# EAGLE schematic EE445L_Baseline_Schematic (EAGLE 9.6.2)
Fall 2021 EE445L This is the baseline schematic
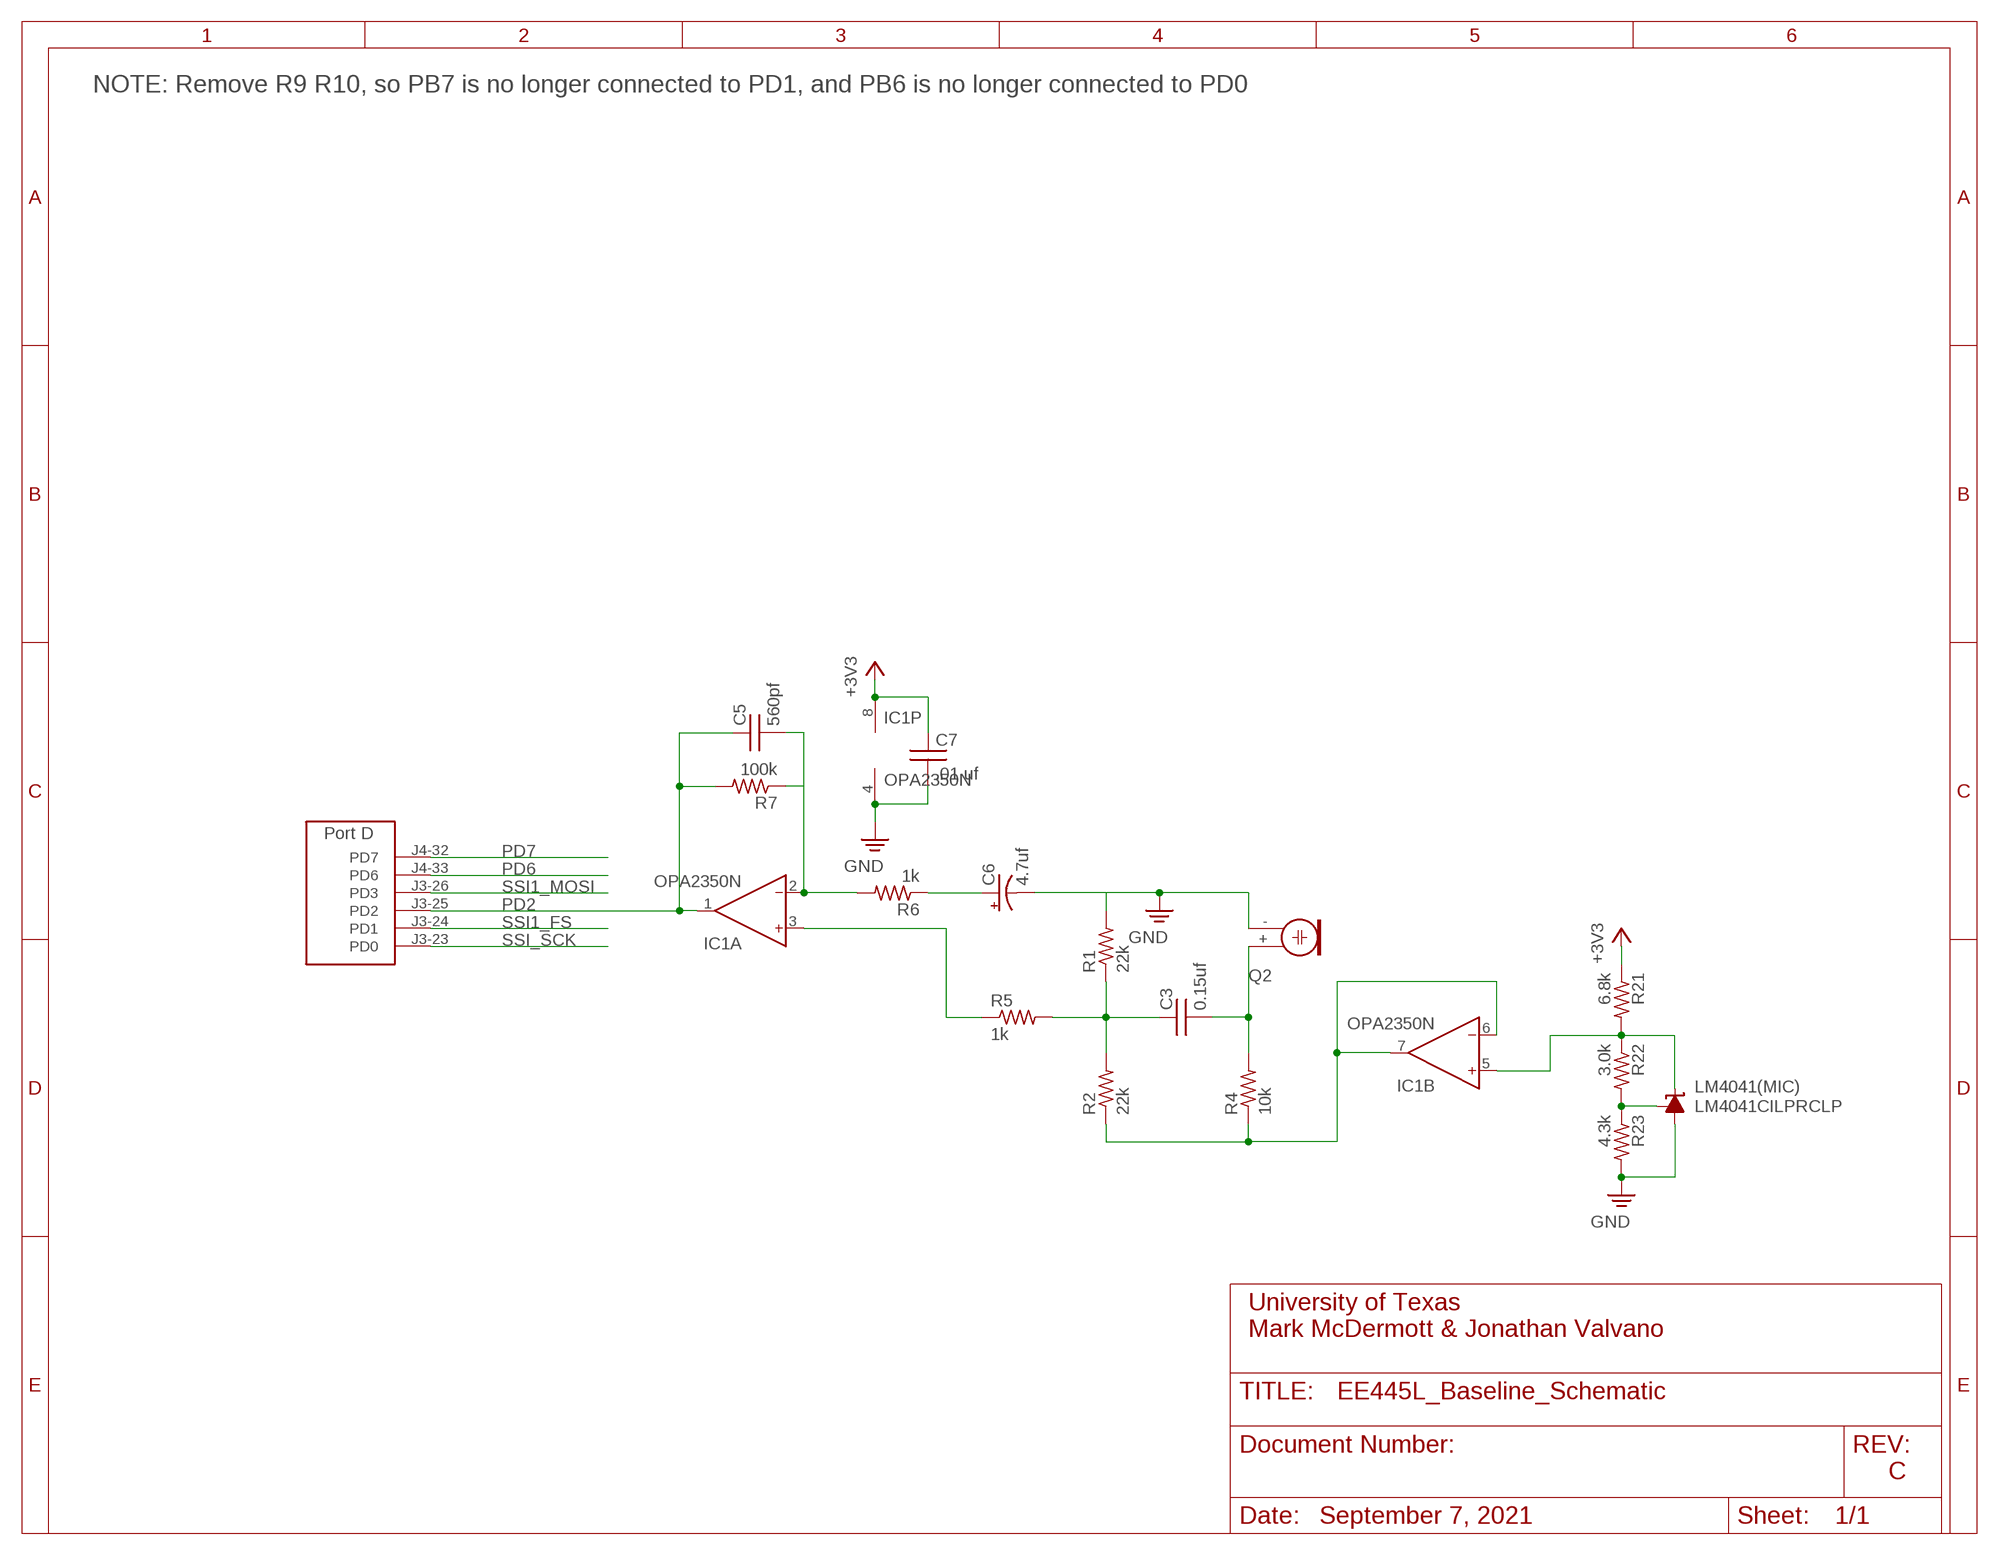
[diagram p0: schematic, sheet 1, part 1 of 2]
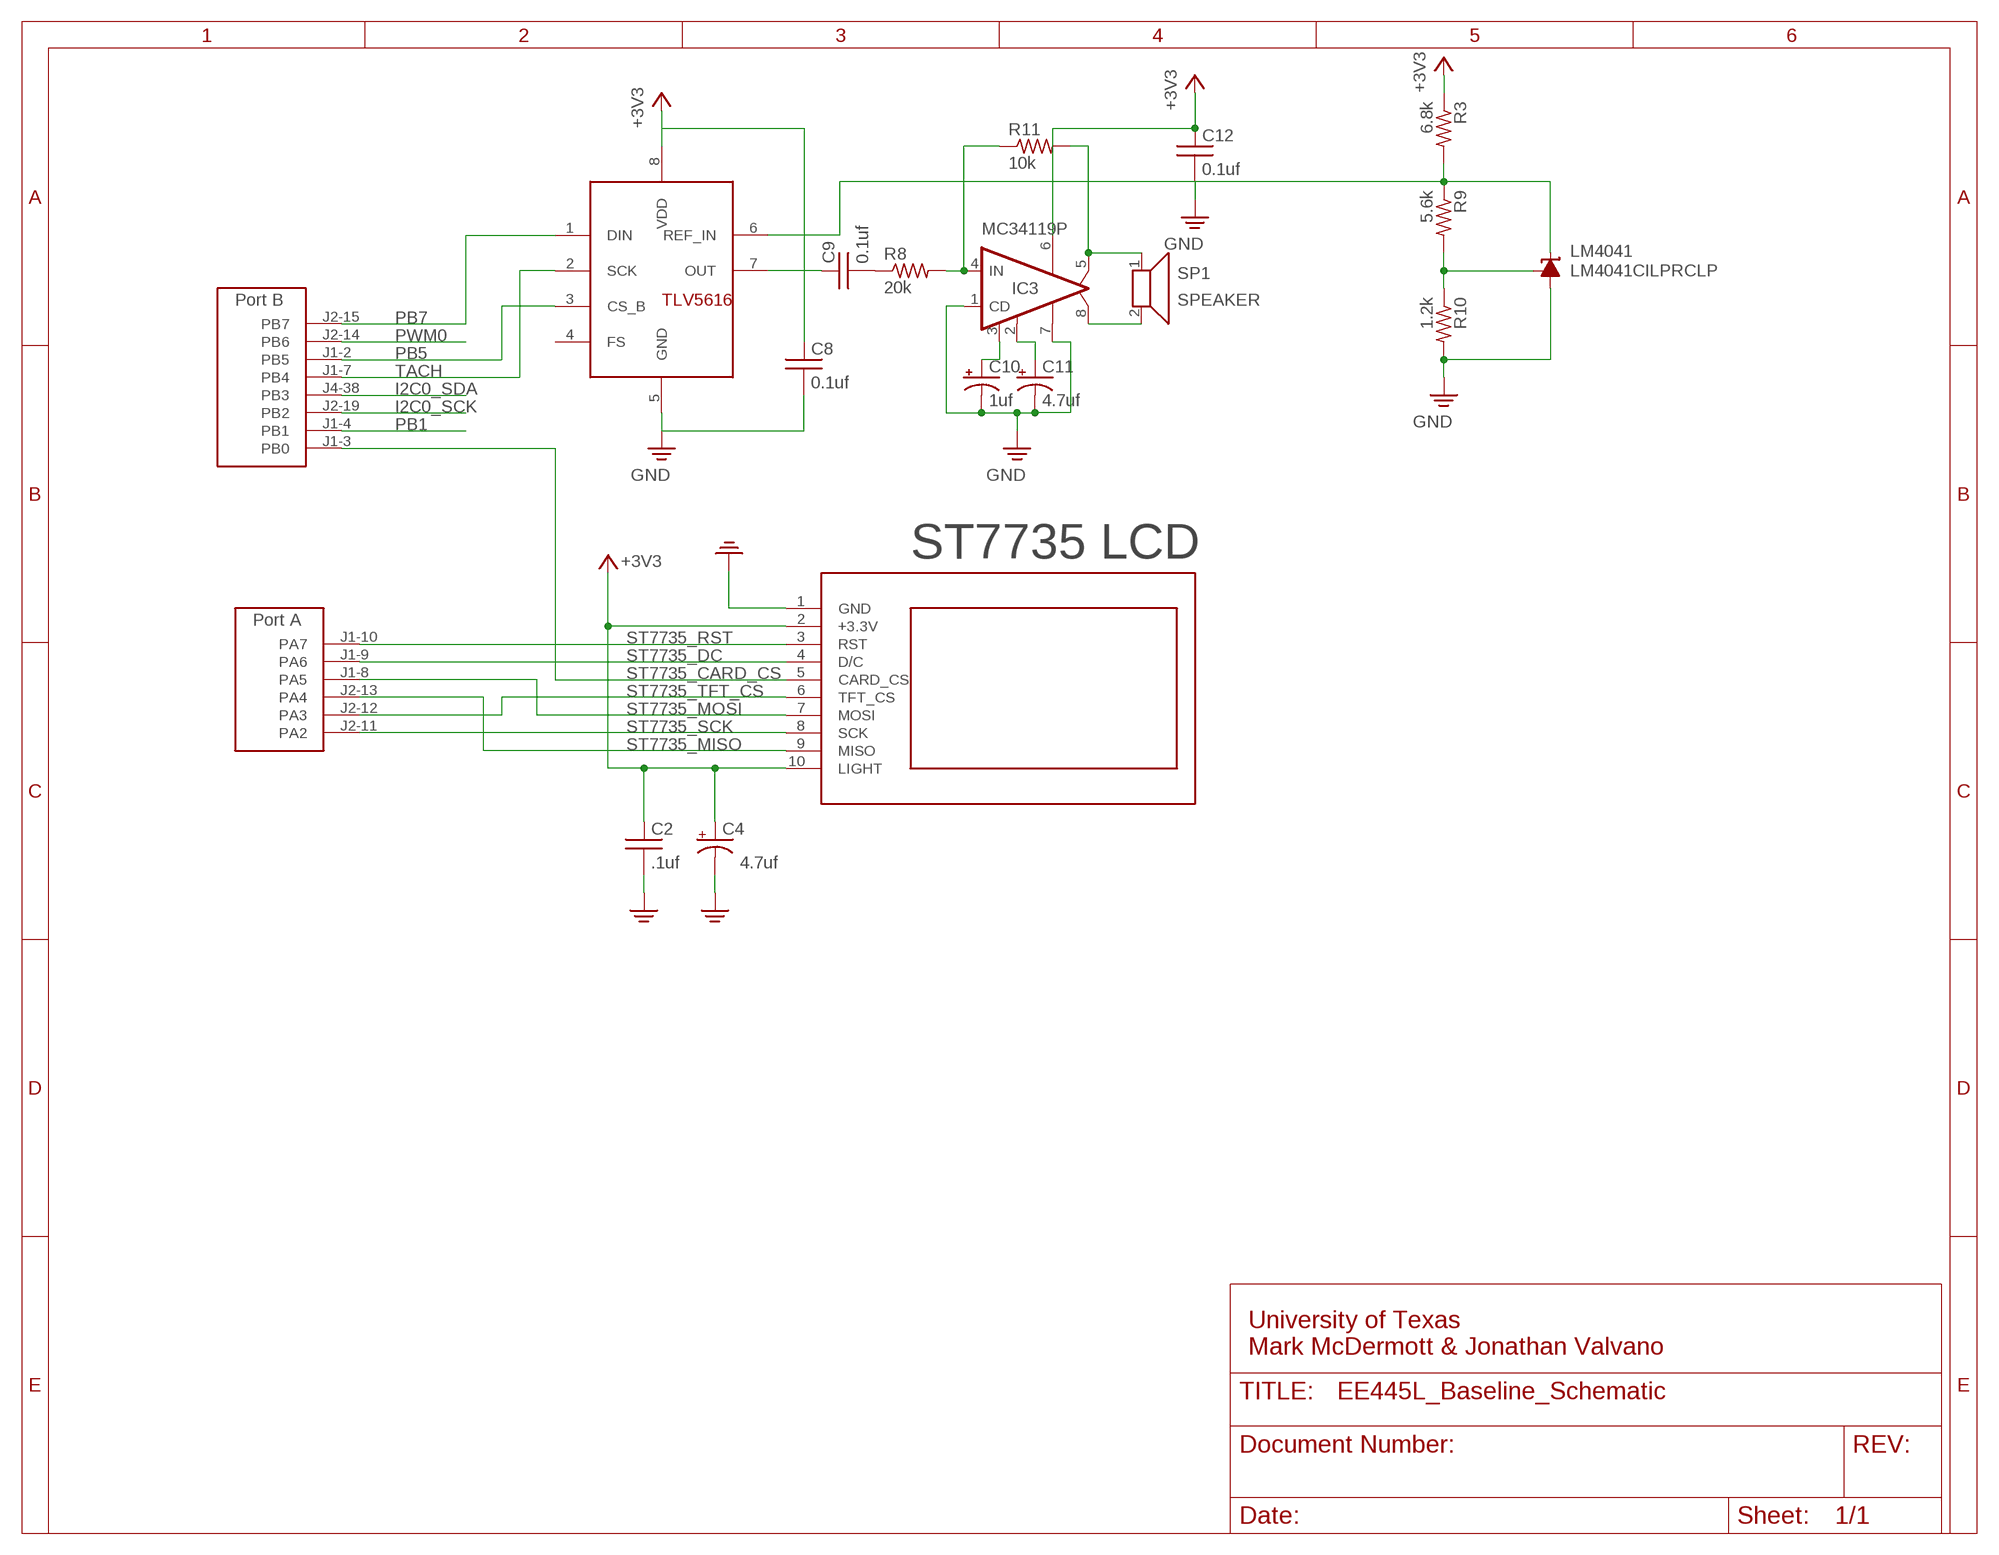
[diagram p1: schematic, sheet 1, part 2 of 2]

## Parts
C2  .1uf  CAPACITOR050-024X044  [CAP200MIL]
C3  0.15uf  CAPACITOR025-024X044  [CAP100MIL]
C4  4.7uf  CAPACITOR_POLARIZEDE5-6  [CAP200MILPOLARIZED]
C5  560pf  CAPACITOR025-024X044  [CAP100MIL]
C6  4.7uf  CAPACITOR_POLARIZEDE5-6  [CAP200MILPOLARIZED]
C7  .01 uf  CAPACITOR025-024X044  [CAP100MIL]
C8  0.1uf  CAPACITOR025-024X044  [CAP100MIL]
C9  0.1uf  CAPACITOR025-024X044  [CAP100MIL]
C10  1uf  CAPACITOR_POLARIZEDE5-6  [CAP200MILPOLARIZED]
C11  4.7uf  CAPACITOR_POLARIZEDE5-6  [CAP200MILPOLARIZED]
C12  0.1uf  CAPACITOR025-024X044  [CAP100MIL]
IC1  OPA2350N  [DIL08]
IC3  MC34119P  [DIL08]
LM4041  LM4041CILPRCLP  [LP_O-PBCY-W3]
LM4041(MIC)  LM4041CILPRCLP  [LP_O-PBCY-W3]
Q2  ELECTRET  [9.7ELECTRET]
R1  22k  RESISTOR0204/5  [RES200MIL]
R2  22k  RESISTOR0204/5  [RES200MIL]
R3  6.8k  RESISTOR0204/7  [RES300MIL]
R4  10k  RESISTOR0204/5  [RES200MIL]
R5  1k  RESISTOR0204/5  [RES200MIL]
R6  1k  RESISTOR0204/5  [RES200MIL]
R7  100k  RESISTOR0204/5  [RES200MIL]
R8  20k  RESISTOR0204/5  [RES200MIL]
R9  5.6k  RESISTOR0204/7  [RES300MIL]
R10  1.2k  RESISTOR0204/7  [RES300MIL]
R11  10k  RESISTOR0204/7  [RES300MIL]
R21  6.8k  RESISTOR0204/7  [RES300MIL]
R22  3.0k  RESISTOR0204/7  [RES300MIL]
R23  4.3k  RESISTOR0204/7  [RES300MIL]
SP1  SPEAKER  [1X02]
U$1  TLV5616  [DIL08]
U$2  TM4C_BP  [TM4C_BOOSTER_PACK]
U$3  ST7735  [ST7735]

## Nets
+3V3: C2.1 C4.+ C7.1 C8.1 C12.1 IC1.8(P:V+) IC3.6(VCC) R3.1 R21.1 U$1.8(VDD) U$3.2(+3.3V) U$3.10(LIGHT)
GND: C2.2 C4.- C6.- C7.2 C8.2 C10.- C11.- C12.2 IC1.4(P:V-) IC3.1(CD) IC3.7(GND) LM4041(MIC).3(A) LM4041.3(A) Q2.- R1.2 R10.2 R23.2 U$1.5(GND) U$3.1(GND)
I2C0_SCK: U$2.J2-19(PB2)
I2C0_SDA: U$2.J4-38(PB3)
MIC_REF: IC1.5(B:IN+) LM4041(MIC).2(C) R21.2 R22.1
MIC_REF_FB: LM4041(MIC).1(FB) R22.2 R23.1
N$1: C9.2 R8.1
N$2: C9.1 U$1.7(OUT)
N$3: IC3.4(IN) R8.2 R11.1
N$4: C3.1 R1.1 R2.2 R5.2
N$5: C6.+ R6.1
N$6: C5.2 IC1.2(A:IN-) R6.2 R7.1
N$7: C3.2 Q2.+ R4.2
N$8: IC3.5(VO1) R11.2 SP1.1
N$9: IC1.3(A:IN+) R5.1
N$10: C10.+ IC3.3(FC1)
N$11: C11.+ IC3.2(FC2)
N$12: IC1.6(B:IN-) IC1.7(B:OUT) R2.1 R4.1
N$14: IC3.8(VO2) SP1.2
PB1: U$2.J1-4(PB1)
PB5: U$1.3(CS_B) U$2.J1-2(PB5)
PB7: U$1.1(DIN) U$2.J2-15(PB7)
PD2: C5.1 IC1.1(A:OUT) R7.2 U$2.J3-25(PD2)
PD6: U$2.J4-33(PD6)
PD7: U$2.J4-32(PD7)
PWM0: U$2.J2-14(PB6)
SSI1_FS: U$2.J3-24(PD1)
SSI1_MOSI: U$2.J3-26(PD3)
SSI_SCK: U$2.J3-23(PD0)
ST7735_CARD_CS: U$2.J1-3(PB0) U$3.5(CARD_CS)
ST7735_DC: U$2.J1-9(PA6) U$3.4(D/C)
ST7735_MISO: U$2.J2-13(PA4) U$3.9(MISO)
ST7735_MOSI: U$2.J1-8(PA5) U$3.7(MOSI)
ST7735_RST: U$2.J1-10(PA7) U$3.3(RST)
ST7735_SCK: U$2.J2-11(PA2) U$3.8(SCK)
ST7735_TFT_CS: U$2.J2-12(PA3) U$3.6(TFT_CS)
TACH: U$1.2(SCK) U$2.J1-7(PB4)
TLV5616_REF_FB: LM4041.1(FB) R9.2 R10.1
TLV5618_REF: LM4041.2(C) R3.2 R9.1 U$1.6(REF_IN)
Unconnected: U$1.4(FS) U$2.J1-1(+3.3V) U$2.J1-5(PE4) U$2.J1-6(PE5) U$2.J2-16(RESET) U$2.J2-17(PF0) U$2.J2-18(PE0) U$2.J2-20(GND2) U$2.J3-21(+5.0V) U$2.J3-22(GND1) U$2.J3-27(PE1) U$2.J3-28(PE2) U$2.J3-29(PE3) U$2.J3-30(PF1) U$2.J4-31(PF4) U$2.J4-34(PC7) U$2.J4-35(PC6) U$2.J4-36(PC5) U$2.J4-37(PC4) U$2.J4-39(PF3) U$2.J4-40(PF2)

## Notes on the sheet
- NOTE: Remove R9 R10, so PB7 is no longer connected to PD1, and PB6 is no longer connected to PD0
- ST7735 LCD
- University of Texas
  Mark McDermott & Jonathan Valvano
- University of Texas
  Mark McDermott & Jonathan Valvano
- C
- September 7, 2021

## Library data of the parts
C2 C3 C5 C7-C9 C12 = EE445L:CAPACITOR: CAPACITOR, American symbol
C4 C6 C10 C11 = EE445L:CAPACITOR_POLARIZED: POLARIZED CAPACITOR, American symbol
IC1 = EE445L:OPA2350: 2.7V to 5.5V Rail-to-Rail I/O Dual Amplifier High-Speed 38MHz, Single-Supply, slew rate 22V/us, 500uV offset, 4uV noise; OC_FARNELL: unknown; OC_NEWARK: unknown
IC3 = EE445L:MC34119: Low Power Audio Amplifier Motorola
LM4041 LM4041(MIC) = EE445L:LM4041CILPR: PRECISION MICROPOWER SHUNT VOLTAGE REFERENCE Adjustable Output Source: http://focus.ti.com/lit/ds/slcs146e/slcs146e.pdf LM4041CILPR Let R1 be the resistor from Vref to +3.3V Let R2 be the resistor from Vref to FB Let R3 be the resistor from FB to ground Vref = 1.23*(1+R3/R2) Iref=(3.3V-Vref)/R1 - 100uA; MPN: LM4041CILP; OC_FARNELL: 1673945; OC_NEWARK: 50M8856
Q2 = EE445L:ELECTRET: Electret microphone Thru hole 2.54mm spacing with 9.7mm diameter
R1-R11 R21-R23 = EE445L:RESISTOR: RESISTOR, American symbol
SP1 = EE445L:SPEAKER: Speaker Connected off PCB with two wires. 32-ohm speaker, AllElectronics, SK-230, http://www.allelectronics.com/make-a-store/item/sk-230/20-mm-32-ohm-speaker/1.html
U$1 = EE445L:TLV5616
U$2 = EE445L:TM4C_BP
U$3 = EE445L:ST7735